# Altium schematic sheet BATTERY SOC.SchDoc
size A; SheetNumber: 16; SheetTotal: 28
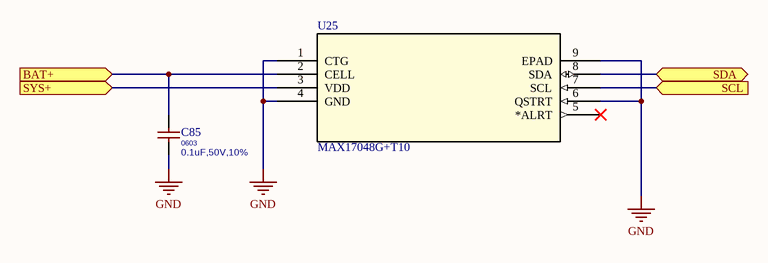
[diagram p0: BATTERY SOC.SchDoc]

## Parts
C85  Package: 0603  [C0603]  (hidden comment: 0.1uF,50V,10%)
U25  MAX17048G+T10  [21-0168E_T822-3_MXM]

## Ports
BAT+ (in), SCL (in), SDA (bidir), SYS+ (in)

## Nets
GND: C85.1 U25.1(CTG) U25.4(GND) U25.6(QSTRT) U25.9(EPAD)
BAT+: C85.2 U25.2(CELL) ; port BAT+
SCL: U25.7(SCL) ; port SCL
SDA: U25.8(SDA) ; port SDA
SYS+: U25.3(VDD) ; port SYS+

Not connected (* = marked no-connect by the designer): U25 5(*ALRT)*

## Library data of the parts
C85 = GCM188R71H104KA57J: CAP CER 0.1UF 50V X7R 0603; Manufacturer: Murata Electronics; Type: SM; Min Operating Temp: -55°C; Max Operating Temp: 125°C; MPN: GCM188R71H104KA57J; Datasheet: https://datasheet.lcsc.com/lcsc/2404081050_Murata-Electronics-GCM188R71H104KA57J_C3011652.pdf; LCSC: C3011652; Value: 0.1uF,50V,10%
U25 = MAX17048G+T10: No Description Available; Mfr_Name: Analog Devices / Maxim Integrated; RefDes: RefDes; Type: Type